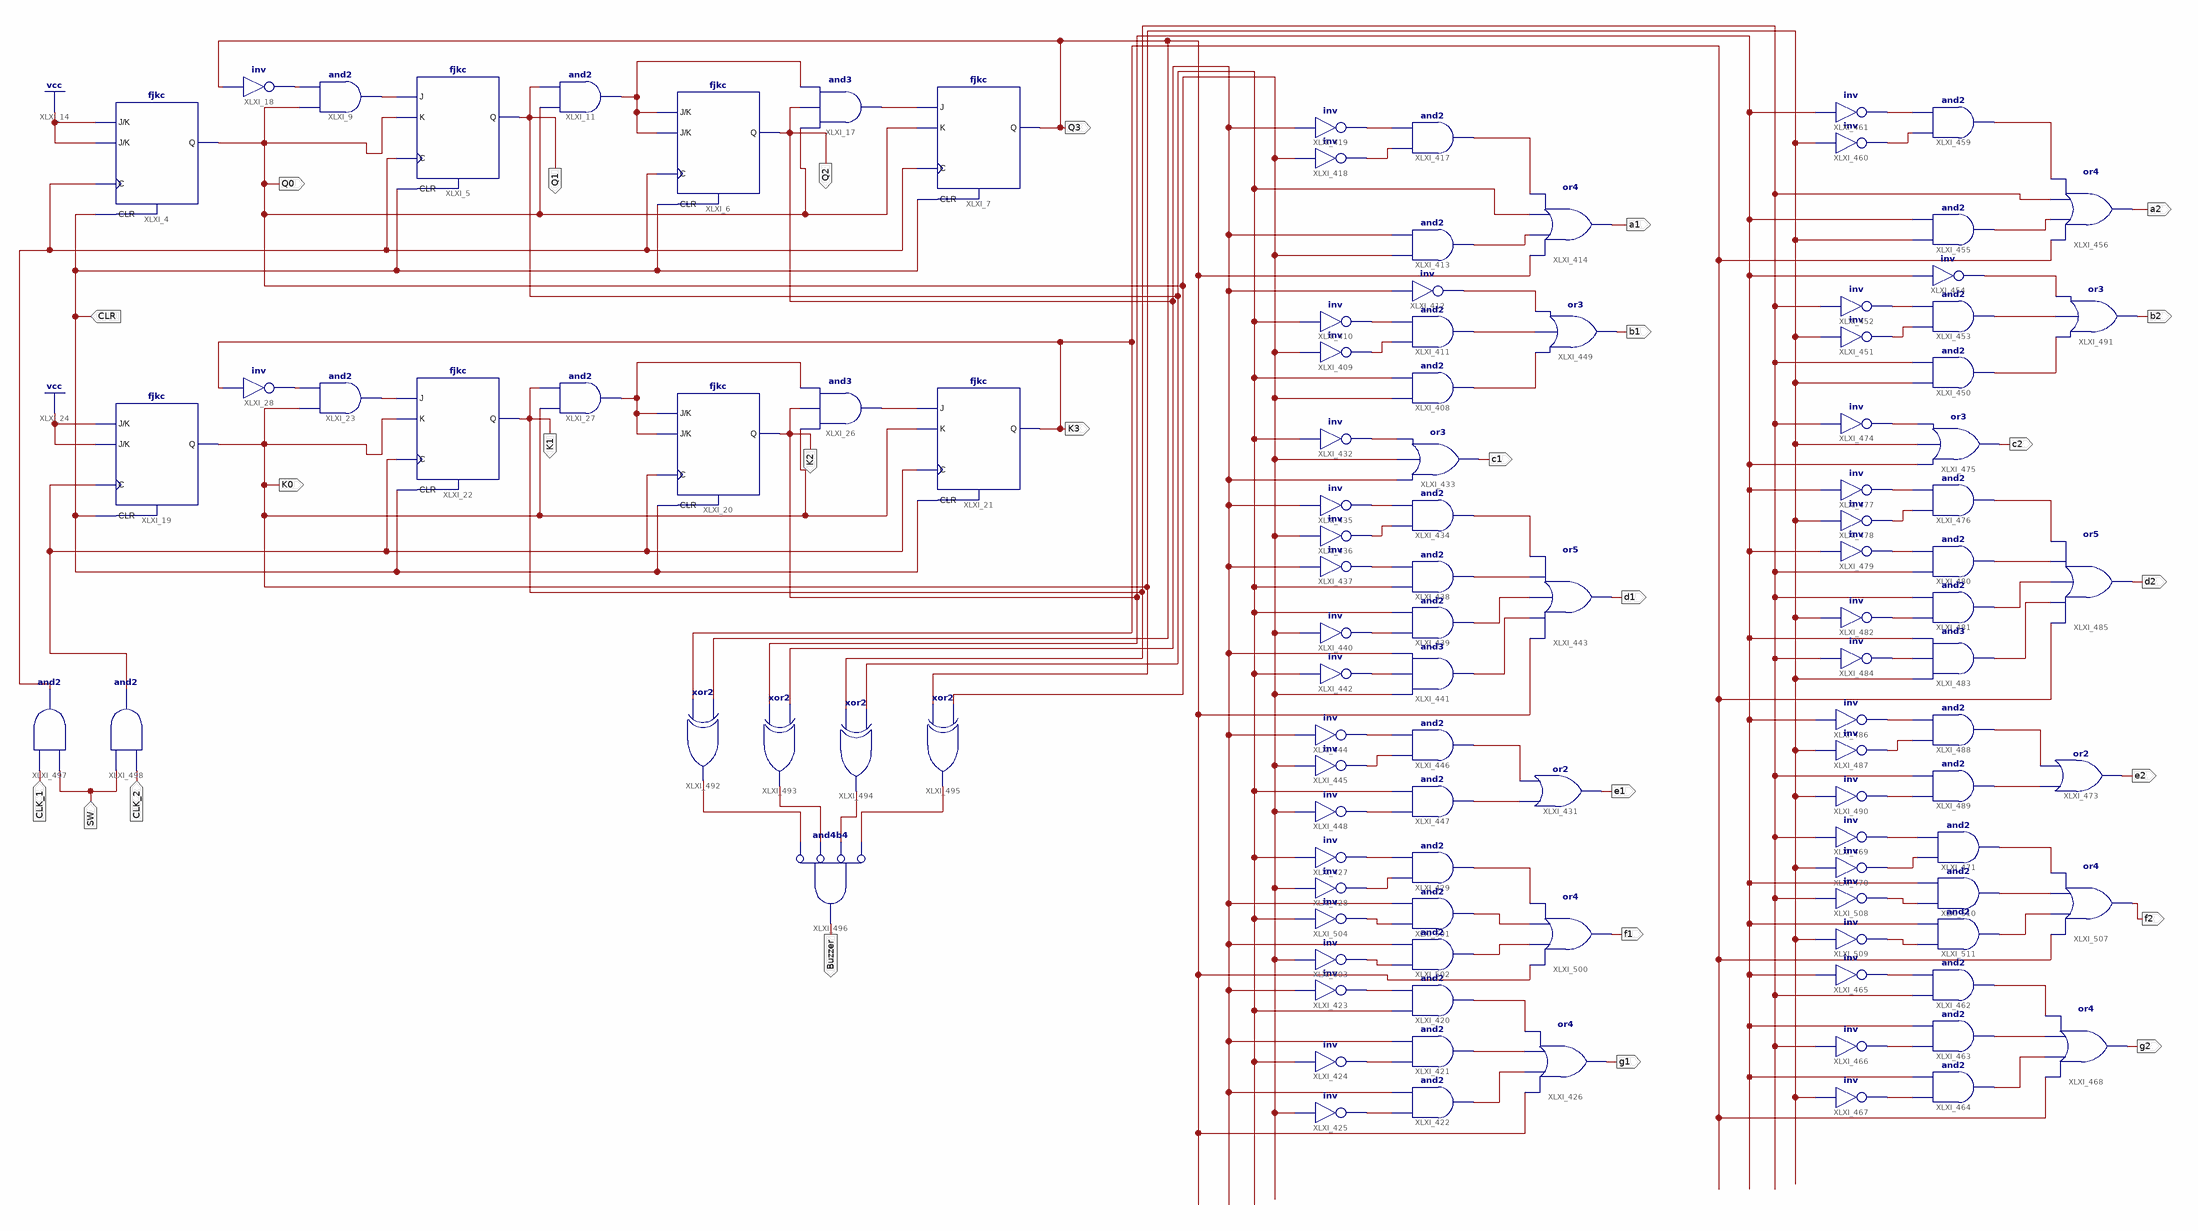
[diagram p0: schematic sheet 1]
// Xilinx ISE schematic Main.sch (spartan6) as structural Verilog: 111 symbols, 27 ports
module Main (
  input  CLR,
  input  CLK_1,
  input  CLK_2,
  input  SW,
  output Q3,
  output Q1,
  output Q0,
  output Q2,
  output K3,
  output K1,
  output K0,
  output K2,
  output b1,
  output a1,
  output g1,
  output f1,
  output c1,
  output d1,
  output e1,
  output b2,
  output a2,
  output g2,
  output f2,
  output c2,
  output d2,
  output e2,
  output Buzzer
);

  wire CLK, CLK2, XLXN_10, XLXN_23, XLXN_39, XLXN_45, XLXN_49, XLXN_50, XLXN_58, XLXN_60, XLXN_591, XLXN_592,
       XLXN_594, XLXN_595, XLXN_597, XLXN_599, XLXN_604, XLXN_605, XLXN_606, XLXN_607, XLXN_608, XLXN_609,
       XLXN_611, XLXN_612, XLXN_613, XLXN_615, XLXN_617, XLXN_618, XLXN_619, XLXN_620, XLXN_621, XLXN_622,
       XLXN_623, XLXN_624, XLXN_625, XLXN_627, XLXN_628, XLXN_629, XLXN_630, XLXN_631, XLXN_633, XLXN_634,
       XLXN_635, XLXN_638, XLXN_639, XLXN_641, XLXN_642, XLXN_644, XLXN_646, XLXN_651, XLXN_652, XLXN_653,
       XLXN_654, XLXN_655, XLXN_656, XLXN_658, XLXN_659, XLXN_660, XLXN_662, XLXN_664, XLXN_665, XLXN_666,
       XLXN_667, XLXN_668, XLXN_669, XLXN_670, XLXN_671, XLXN_672, XLXN_674, XLXN_675, XLXN_676, XLXN_677,
       XLXN_678, XLXN_680, XLXN_681, XLXN_682, XLXN_690, XLXN_691, XLXN_692, XLXN_693, XLXN_704, XLXN_705,
       XLXN_709, XLXN_710, XLXN_712, XLXN_713, XLXN_714, XLXN_715;

  fjkc XLXI_4 (.C(CLK), .CLR(CLR), .J(1'b1), .K(1'b1), .Q(Q0));
  fjkc XLXI_5 (.C(CLK), .CLR(CLR), .J(XLXN_10), .K(Q0), .Q(Q1));
  fjkc XLXI_6 (.C(CLK), .CLR(CLR), .J(XLXN_45), .K(XLXN_45), .Q(Q2));
  fjkc XLXI_7 (.C(CLK), .CLR(CLR), .J(XLXN_23), .K(Q0), .Q(Q3));
  and XLXI_9 (XLXN_10, Q0, XLXN_39);
  and XLXI_11 (XLXN_45, Q0, Q1);
  and XLXI_17 (XLXN_23, Q0, Q2, XLXN_45);
  not XLXI_18 (XLXN_39, Q3);
  fjkc XLXI_19 (.C(CLK2), .CLR(CLR), .J(1'b1), .K(1'b1), .Q(K0));
  fjkc XLXI_20 (.C(CLK2), .CLR(CLR), .J(XLXN_60), .K(XLXN_60), .Q(K2));
  fjkc XLXI_21 (.C(CLK2), .CLR(CLR), .J(XLXN_50), .K(K0), .Q(K3));
  fjkc XLXI_22 (.C(CLK2), .CLR(CLR), .J(XLXN_49), .K(K0), .Q(K1));
  and XLXI_23 (XLXN_49, K0, XLXN_58);
  and XLXI_26 (XLXN_50, K0, K2, XLXN_60);
  and XLXI_27 (XLXN_60, K0, K1);
  not XLXI_28 (XLXN_58, K3);
  and XLXI_408 (XLXN_634, Q0, Q1);
  not XLXI_409 (XLXN_591, Q0);
  not XLXI_410 (XLXN_592, Q1);
  and XLXI_411 (XLXN_633, XLXN_591, XLXN_592);
  not XLXI_412 (XLXN_635, Q2);
  and XLXI_413 (XLXN_597, Q0, Q2);
  and XLXI_417 (XLXN_599, XLXN_594, XLXN_595);
  not XLXI_418 (XLXN_594, Q0);
  not XLXI_419 (XLXN_595, Q2);
  and XLXI_420 (XLXN_604, Q1, XLXN_609);
  and XLXI_421 (XLXN_605, XLXN_608, Q2);
  and XLXI_422 (XLXN_606, XLXN_607, Q2);
  not XLXI_423 (XLXN_609, Q2);
  not XLXI_424 (XLXN_608, Q1);
  not XLXI_425 (XLXN_607, Q0);
  or XLXI_426 (g1, Q3, XLXN_606, XLXN_605, XLXN_604);
  not XLXI_427 (XLXN_612, Q1);
  not XLXI_428 (XLXN_613, Q0);
  and XLXI_429 (XLXN_611, XLXN_613, XLXN_612);
  or XLXI_431 (e1, XLXN_631, XLXN_630);
  not XLXI_432 (XLXN_615, Q1);
  or XLXI_433 (c1, Q2, Q0, XLXN_615);
  and XLXI_434 (XLXN_619, XLXN_618, XLXN_617);
  not XLXI_435 (XLXN_617, Q2);
  not XLXI_436 (XLXN_618, Q0);
  not XLXI_437 (XLXN_623, Q2);
  and XLXI_438 (XLXN_620, Q1, XLXN_623);
  and XLXI_439 (XLXN_621, XLXN_624, Q1);
  not XLXI_440 (XLXN_624, Q0);
  and XLXI_441 (XLXN_622, Q0, XLXN_625, Q2);
  not XLXI_442 (XLXN_625, Q1);
  or XLXI_443 (d1, Q3, XLXN_622, XLXN_621, XLXN_620, XLXN_619);
  not XLXI_444 (XLXN_627, Q2);
  not XLXI_445 (XLXN_628, Q0);
  and XLXI_446 (XLXN_630, XLXN_628, XLXN_627);
  and XLXI_447 (XLXN_631, XLXN_629, Q1);
  not XLXI_448 (XLXN_629, Q0);
  or XLXI_449 (b1, XLXN_634, XLXN_633, XLXN_635);
  and XLXI_450 (XLXN_681, K0, K1);
  not XLXI_451 (XLXN_638, K0);
  not XLXI_452 (XLXN_639, K1);
  and XLXI_453 (XLXN_680, XLXN_638, XLXN_639);
  not XLXI_454 (XLXN_682, K2);
  and XLXI_455 (XLXN_644, K0, K2);
  or XLXI_456 (a2, K3, XLXN_644, K1, XLXN_646);
  and XLXI_459 (XLXN_646, XLXN_641, XLXN_642);
  not XLXI_460 (XLXN_641, K0);
  not XLXI_461 (XLXN_642, K2);
  and XLXI_462 (XLXN_651, K1, XLXN_656);
  and XLXI_463 (XLXN_652, XLXN_655, K2);
  and XLXI_464 (XLXN_653, XLXN_654, K2);
  not XLXI_465 (XLXN_656, K2);
  not XLXI_466 (XLXN_655, K1);
  not XLXI_467 (XLXN_654, K0);
  or XLXI_468 (g2, K3, XLXN_653, XLXN_652, XLXN_651);
  not XLXI_469 (XLXN_659, K1);
  not XLXI_470 (XLXN_660, K0);
  and XLXI_471 (XLXN_658, XLXN_660, XLXN_659);
  or XLXI_473 (e2, XLXN_678, XLXN_677);
  not XLXI_474 (XLXN_662, K1);
  or XLXI_475 (c2, K2, K0, XLXN_662);
  and XLXI_476 (XLXN_666, XLXN_665, XLXN_664);
  not XLXI_477 (XLXN_664, K2);
  not XLXI_478 (XLXN_665, K0);
  not XLXI_479 (XLXN_670, K2);
  and XLXI_480 (XLXN_667, K1, XLXN_670);
  and XLXI_481 (XLXN_668, XLXN_671, K1);
  not XLXI_482 (XLXN_671, K0);
  and XLXI_483 (XLXN_669, K0, XLXN_672, K2);
  not XLXI_484 (XLXN_672, K1);
  or XLXI_485 (d2, K3, XLXN_669, XLXN_668, XLXN_667, XLXN_666);
  not XLXI_486 (XLXN_674, K2);
  not XLXI_487 (XLXN_675, K0);
  and XLXI_488 (XLXN_677, XLXN_675, XLXN_674);
  and XLXI_489 (XLXN_678, XLXN_676, K1);
  not XLXI_490 (XLXN_676, K0);
  or XLXI_491 (b2, XLXN_681, XLXN_680, XLXN_682);
  xor XLXI_492 (XLXN_690, K3, Q3);
  xor XLXI_493 (XLXN_691, K2, Q2);
  xor XLXI_494 (XLXN_692, K1, Q1);
  xor XLXI_495 (XLXN_693, K0, Q0);
  and XLXI_496 (Buzzer, ~XLXN_690, ~XLXN_691, ~XLXN_692, ~XLXN_693);  // and4b4
  and XLXI_497 (CLK, SW, CLK_1);
  and XLXI_498 (CLK2, CLK_2, SW);
  or XLXI_500 (f1, Q3, XLXN_715, XLXN_714, XLXN_611);
  and XLXI_501 (XLXN_714, XLXN_704, Q2);
  and XLXI_502 (XLXN_715, XLXN_705, Q2);
  not XLXI_503 (XLXN_705, Q0);
  not XLXI_504 (XLXN_704, Q1);
  or XLXI_414 (a1, Q3, XLXN_597, Q1, XLXN_599);
  or XLXI_507 (f2, K3, XLXN_712, XLXN_713, XLXN_658);
  not XLXI_508 (XLXN_709, K1);
  not XLXI_509 (XLXN_710, K0);
  and XLXI_510 (XLXN_713, XLXN_709, K2);
  and XLXI_511 (XLXN_712, XLXN_710, K2);
endmodule
